# EAGLE design v1.2.0 (EAGLE 9.3.0)

## Sheet 1 of 2
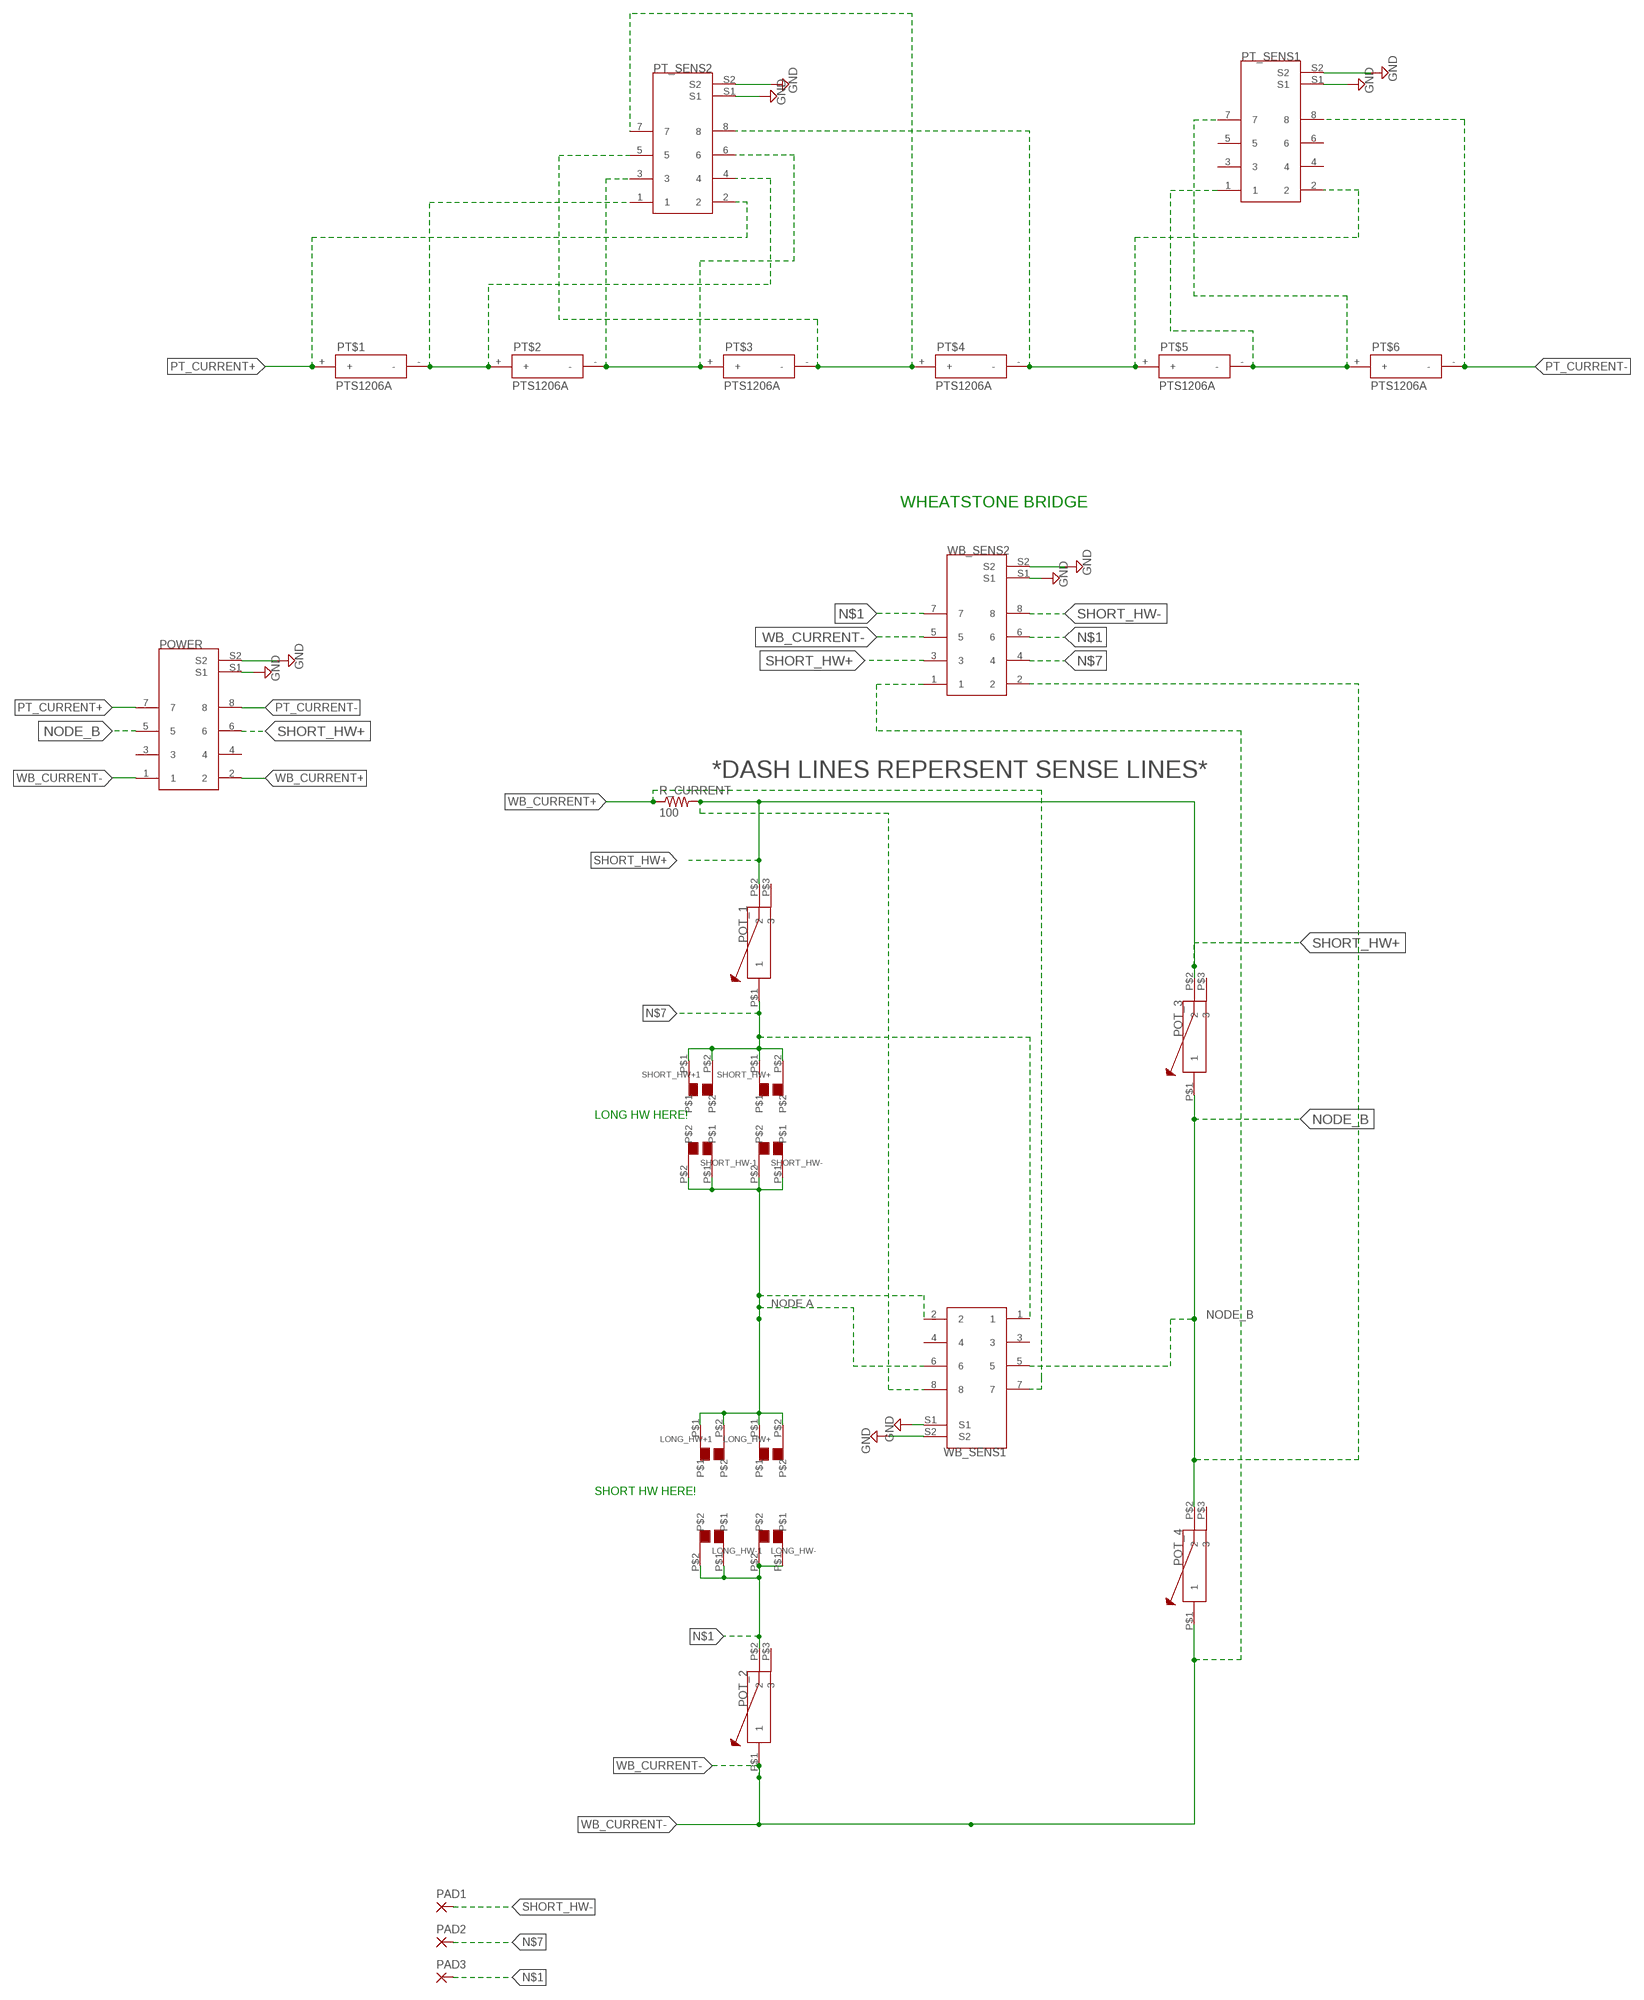
[diagram p0: schematic, sheet 1]

### Parts
LONG_HW+  WIREPOINT_1A  [WIREPOINT]
LONG_HW+1  WIREPOINT_1A  [WIREPOINT]
LONG_HW-  WIREPOINT_1A  [WIREPOINT]
LONG_HW-1  WIREPOINT_1A  [WIREPOINT]
PAD1  2,15/1,0  [2,15/1,0]
PAD2  2,15/1,0  [2,15/1,0]
PAD3  2,15/1,0  [2,15/1,0]
POT_1  67WR200LFR$1  [67WR200LF]
POT_2  67WR200LFR$1  [67WR200LF]
POT_3  67WR200LFR$1  [67WR200LF]
POT_4  67WR200LFR$1  [67WR200LF]
POWER  RJ45_CONNECTOR  [RJ45_CONNNECTOR]
PT$1  PTS1206A  [CAPMP3216X166]
PT$2  PTS1206A  [CAPMP3216X166]
PT$3  PTS1206A  [CAPMP3216X166]
PT$4  PTS1206A  [CAPMP3216X166]
PT$5  PTS1206A  [CAPMP3216X166]
PT$6  PTS1206A  [CAPMP3216X166]
PT_SENS1  RJ45_CONNECTOR  [RJ45_CONNNECTOR]
PT_SENS2  RJ45_CONNECTOR  [RJ45_CONNNECTOR]
R_CURRENT  100  R-US_M0805  [M0805]
SHORT_HW+  WIREPOINT_1A  [WIREPOINT]
SHORT_HW+1  WIREPOINT_1A  [WIREPOINT]
SHORT_HW-  WIREPOINT_1A  [WIREPOINT]
SHORT_HW-1  WIREPOINT_1A  [WIREPOINT]
WB_SENS1  RJ45_CONNECTOR  [RJ45_CONNNECTOR]
WB_SENS2  RJ45_CONNECTOR  [RJ45_CONNNECTOR]

### Nets
GND: POWER.S1 POWER.S2 PT_SENS1.S1 PT_SENS1.S2 PT_SENS2.S1 PT_SENS2.S2 WB_SENS1.S1 WB_SENS1.S2 WB_SENS2.S1 WB_SENS2.S2
N$1: LONG_HW-1.P$1 LONG_HW-1.P$2 LONG_HW-.P$1 LONG_HW-.P$2 PAD3.1(P) POT_2.P$2 WB_SENS2.6 WB_SENS2.7
N$3: PT$2.- PT$3.+ PT_SENS2.3 PT_SENS2.6
N$4: PT$3.- PT$4.+ PT_SENS2.5 PT_SENS2.7
N$5: PT$4.- PT$5.+ PT_SENS1.2 PT_SENS2.8
N$6: PT$5.- PT$6.+ PT_SENS1.1 PT_SENS1.7
N$7: PAD2.1(P) POT_1.P$1 SHORT_HW+1.P$1 SHORT_HW+1.P$2 SHORT_HW+.P$1 SHORT_HW+.P$2 WB_SENS1.1 WB_SENS2.4
N$9: PT$1.- PT$2.+ PT_SENS2.1 PT_SENS2.4
NODE_B: POT_3.P$1 POT_4.P$2 POWER.5 WB_SENS1.5 WB_SENS2.2
PT_CURRENT+: POWER.7 PT$1.+ PT_SENS2.2
PT_CURRENT-: POWER.8 PT$6.- PT_SENS1.8
SHORT_HW+: POT_1.P$2 POT_3.P$2 POWER.6 R_CURRENT.2 WB_SENS1.8 WB_SENS2.3
SHORT_HW-: LONG_HW+1.P$1 LONG_HW+1.P$2 LONG_HW+.P$1 LONG_HW+.P$2 PAD1.1(P) SHORT_HW-1.P$1 SHORT_HW-1.P$2 SHORT_HW-.P$1 SHORT_HW-.P$2 WB_SENS1.2 WB_SENS1.6 WB_SENS2.8
WB_CURRENT+: POWER.2 R_CURRENT.1 WB_SENS1.7
WB_CURRENT-: POT_2.P$1 POT_4.P$1 POWER.1 WB_SENS2.1 WB_SENS2.5
Unconnected: POT_1.P$3 POT_2.P$3 POT_3.P$3 POT_4.P$3 POWER.3 POWER.4 PT_SENS1.3 PT_SENS1.4 PT_SENS1.5 PT_SENS1.6 WB_SENS1.3 WB_SENS1.4

### Notes on the sheet
- WHEATSTONE BRIDGE
- *DASH LINES REPERSENT SENSE LINES*
- LONG HW HERE!
- NODE A
- SHORT HW HERE!

## Sheet 2 of 2

## Library data of the parts
LONG_HW+ LONG_HW+1 LONG_HW- LONG_HW-1 SHORT_HW+ SHORT_HW+1 SHORT_HW- SHORT_HW-1 = WIREPOINT:WIREPOINT_1
PAD1-PAD3 = wirepad:2,15/1,0: THROUGH-HOLE PAD
POT_1-POT_4 = POTENTIOMETER_67WR200LFR:67WR200LF
POWER PT_SENS1 PT_SENS2 WB_SENS1 WB_SENS2 = RJ45_CONNECTOR:RJ45_CONNECTOR
PT$1-PT$6 = PTS1206:PTS1206
R_CURRENT = resistor:R-US_: RESISTOR, American symbol

## Board
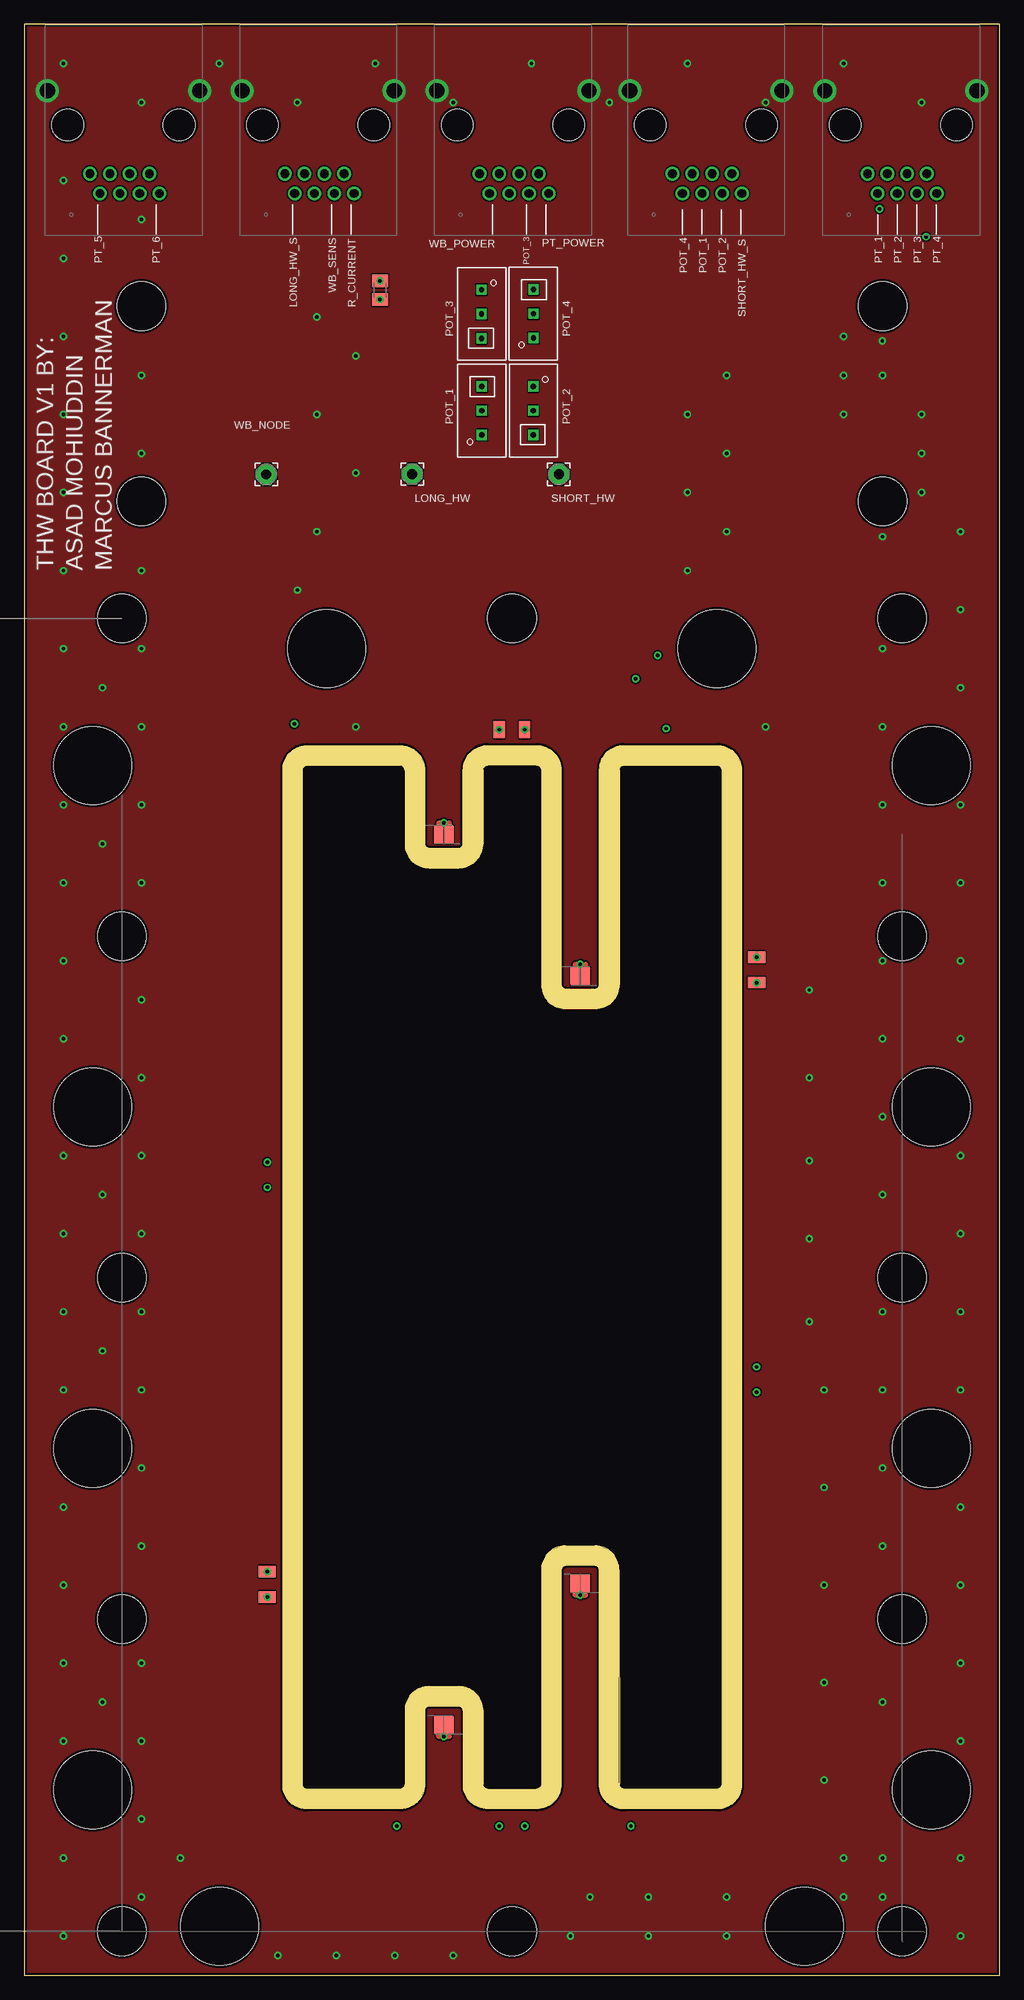
[diagram p1: board, top side]
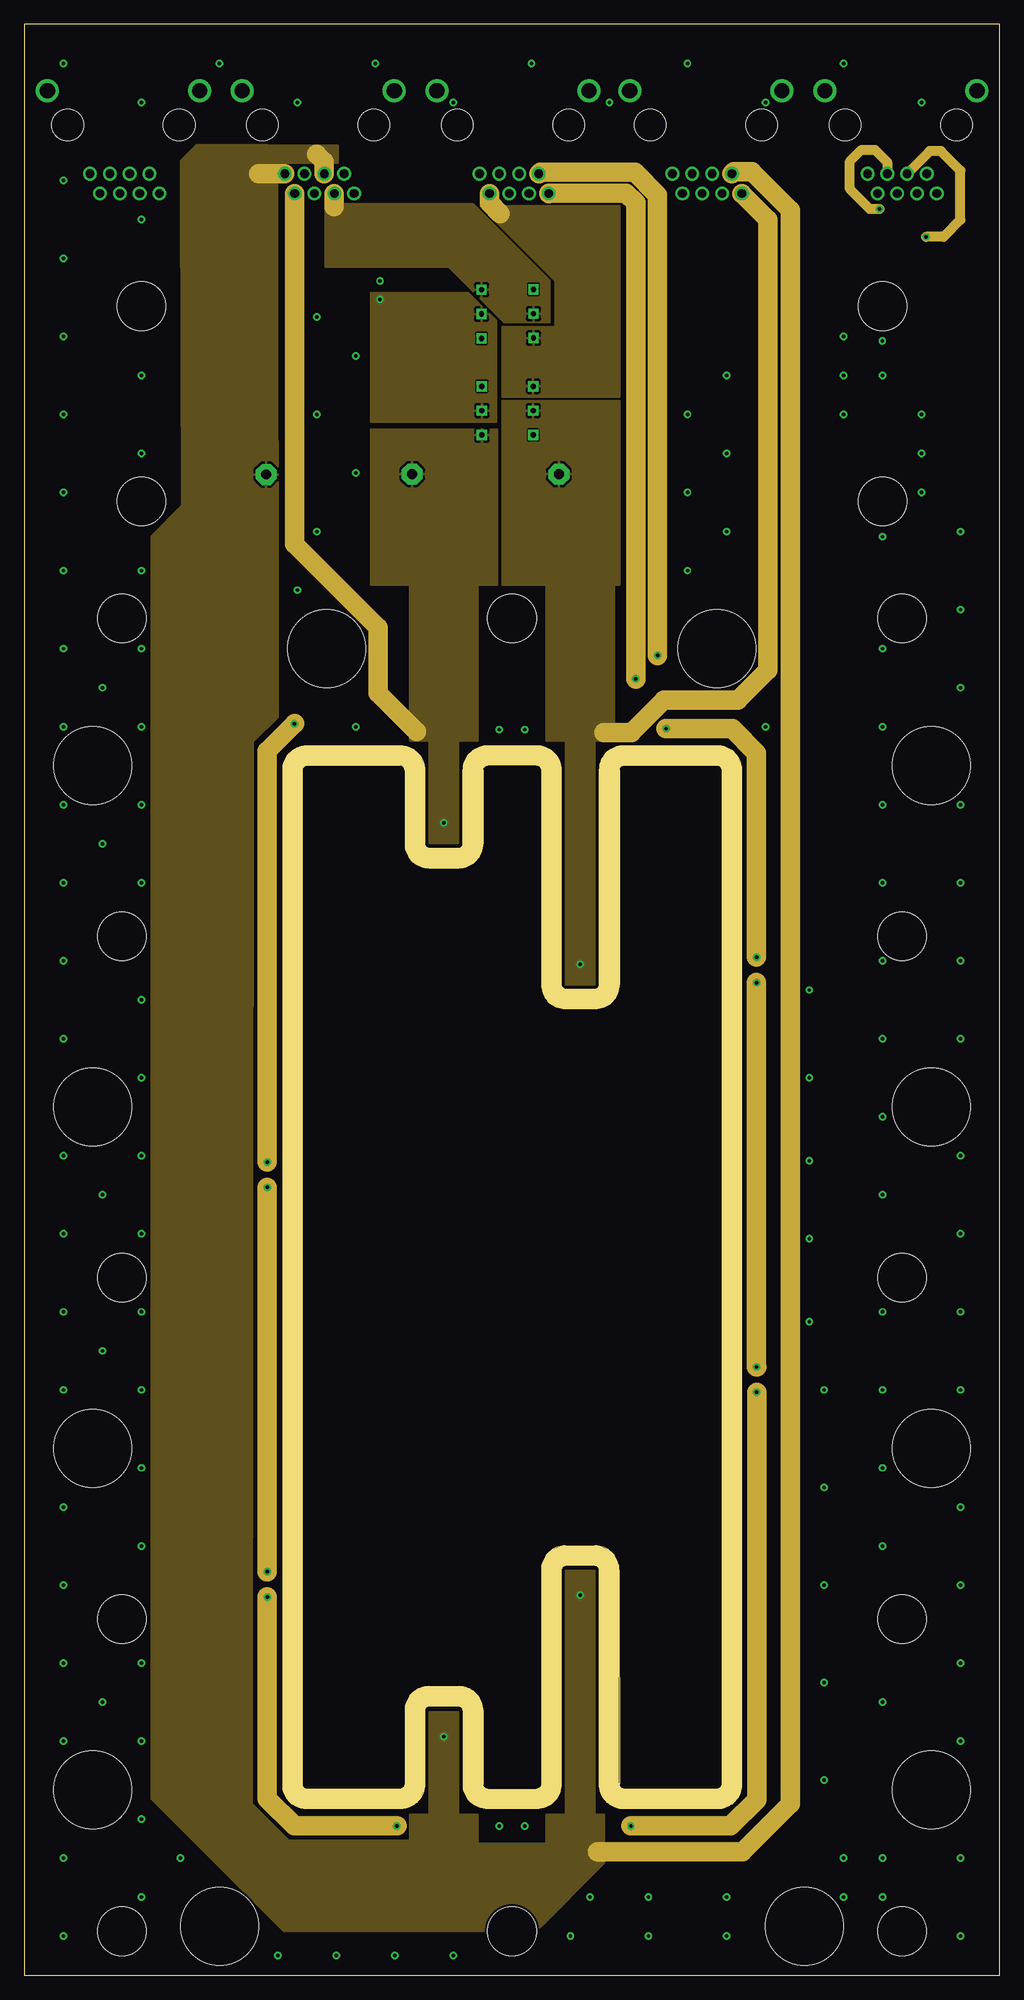
[diagram p2: board, inner layer Route2]
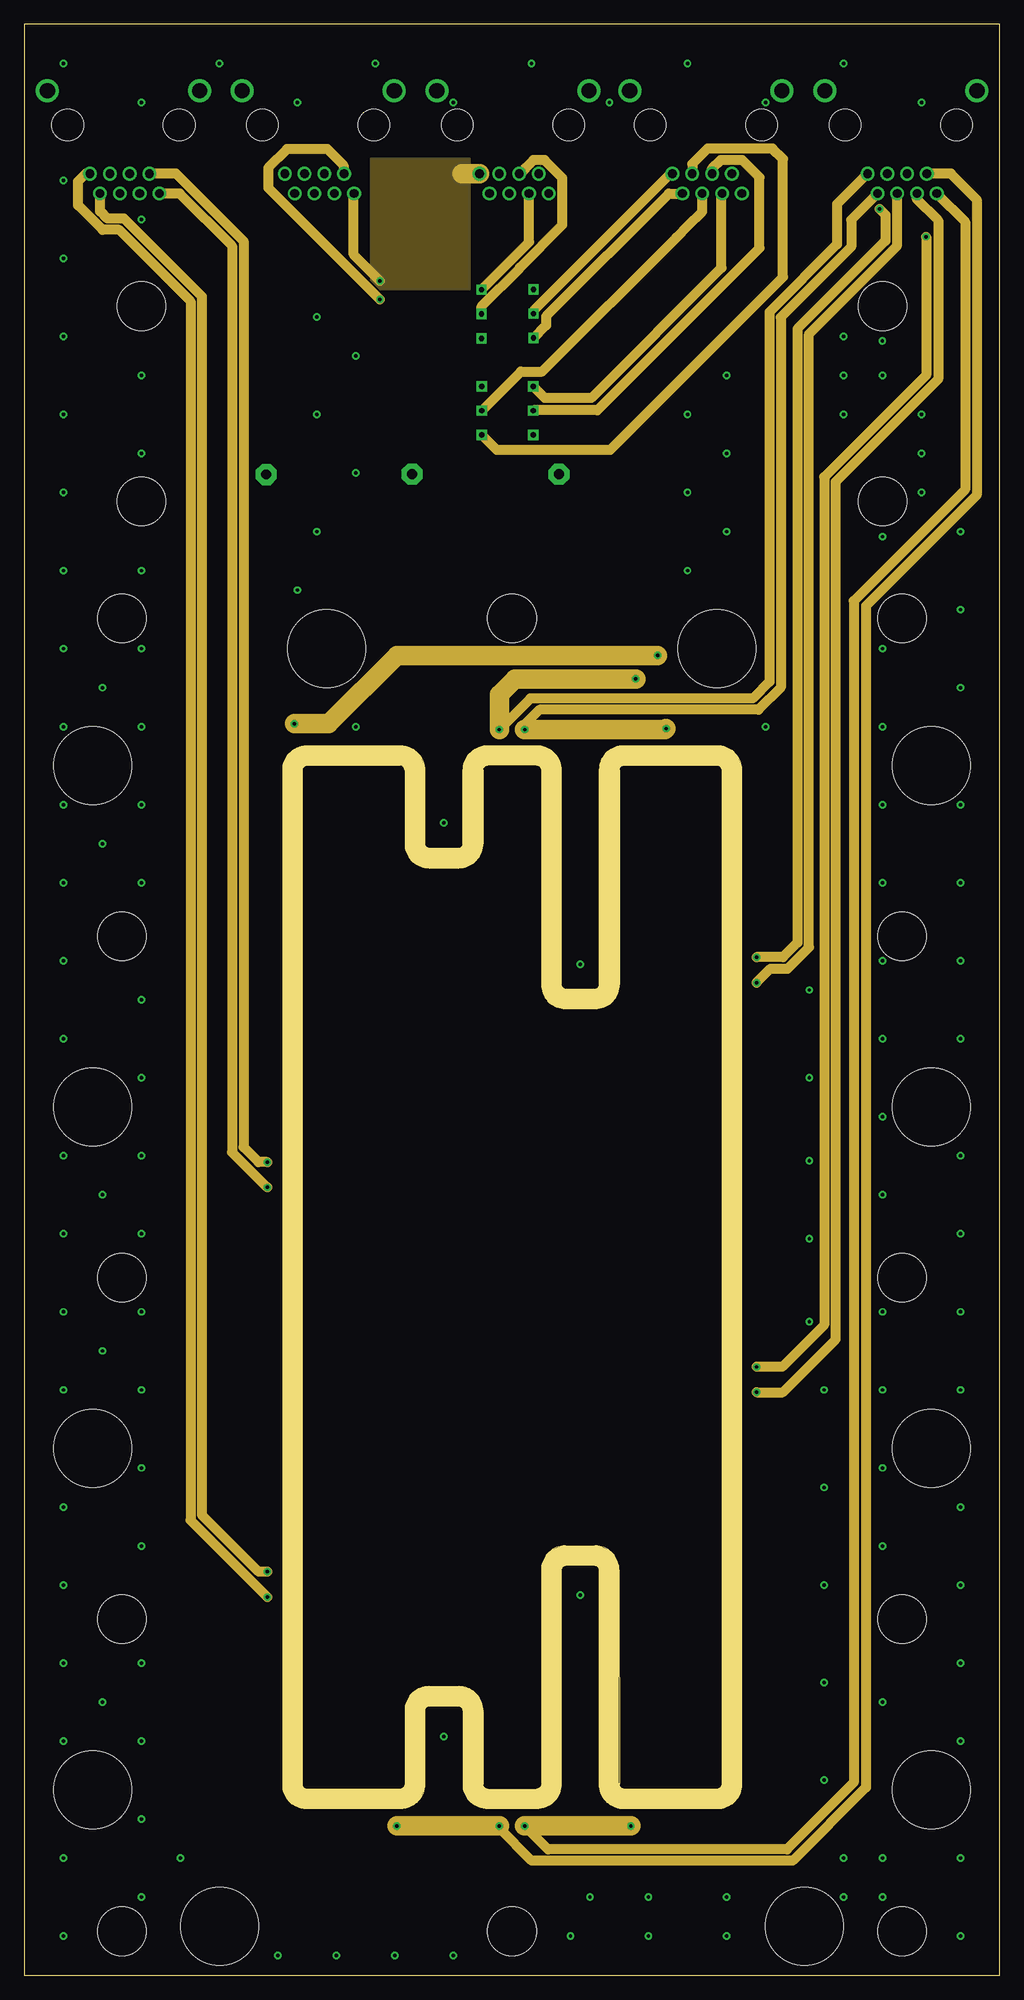
[diagram p3: board, inner layer Route3]
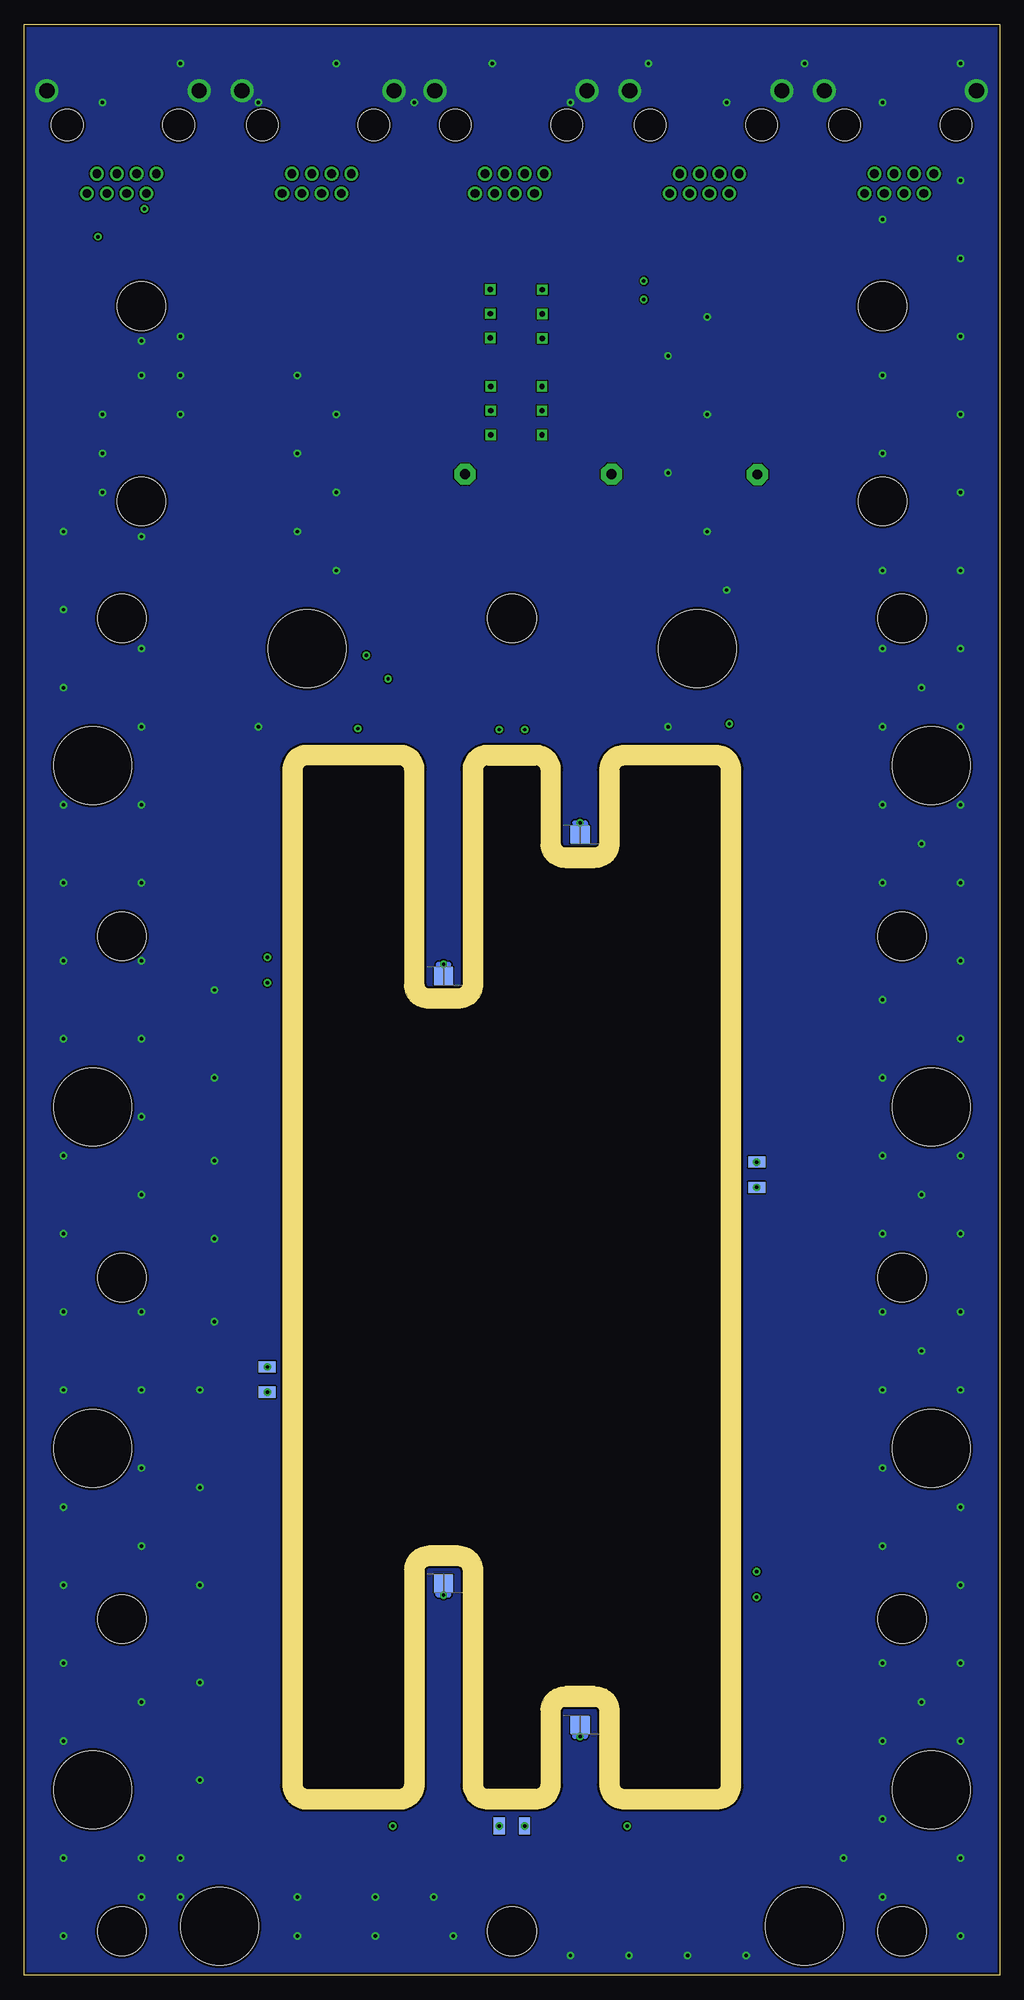
[diagram p4: board, bottom side, seen from below]

Size 100 x 200 mm. Coordinates in mm from the lower left corner, seen from the top.
Outline: 29.01,124.06 38.52,124.06 arc-90 39.02,123.56 39.02,115.99 arc90 41.48,113.53 44.56,113.53 arc90 47.02,115.99 47.02,123.56 arc-90 47.52,124.06 52.52,124.06 arc-90 53.02,123.56 53.02,101.55 arc90 55.48,99.09 58.56,99.09 arc90 61.02,101.55 61,123.56 arc-90 61.5,124.06 71.02,124.06 arc-90 71.52,123.56 71.52,19.56 arc-90 71.02,19.06 61.51,19.06 arc-90 61.01,19.56
Outline: 29.02,124.06 arc90 28.52,123.56 28.52,19.47 arc90 28.93,19.06 38.52,19.06 arc90 39.02,19.56 39.02,27.13 arc-90 41.48,29.59 44.56,29.59 arc-90 47.02,27.13 47.02,19.56 arc90 47.52,19.06 52.53,19.06 arc90 53.03,19.56
Outline: 61.01,19.54 60.99,41.55 arc90 58.53,44.01 55.47,44.01 arc90 53.01,41.55 53.03,19.54
Outline: 0,0 100,0 100,200 0,200 0,0
Outline: 28.94,17.04 arc-90 26.51,19.47 26.51,123.56 arc-90 29.02,126.07 38.52,126.07 arc-90 41.03,123.56 41.03,116.02 arc90 41.5,115.55 44.58,115.55 arc90 45,115.97 45,123.54 arc-90 47.54,126.08 52.51,126.08 arc-90 55.04,123.55 55.04,101.56 arc90 55.5,101.1 58.52,101.1 arc90 58.99,101.57 58.99,123.6 arc-90 61.47,126.08 71.03,126.08 arc-90 73.53,123.58 73.53,19.51 arc-90 71.05,17.03 61.5,17.03 arc-90 58.97,19.56 58.97,41.52 arc90 58.5,41.99 55.51,41.99 arc90 55.04,41.52 55.04,19.56 arc-90 52.53,17.05 47.51,17.05 arc-90 45.01,19.55 45.01,27.1 arc90 44.53,27.58 41.49,27.58 arc90 41.03,27.12 41.03,19.54 arc-90 38.53,17.04 28.94,17.04
Copper layers (1*2*3*16): Top 0.035mm / dielectric 0.8675mm / Route2 0.035mm / dielectric 0.15mm / Route3 0.035mm / dielectric 0.2mm / Bottom 0.035mm
Design rules "default *": minimum track width 6mil, minimum drill 0.35mm, track to track 6mil, track to pad 6mil, pad to pad 6mil, via to via 6mil, smd to smd 6mil, copper to edge 10mil, drill to drill 6mil, minimum pad ring 10mil, minimum via ring 8mil, stop-mask expansion 4mil, vias tented up to drill 0mil, thermal gap 10mil
Holes 5 mm at 50,139.1 10,36.5 90,36.5 50,4.5 90,106.5 10,139.1 90,139.1 10,4.5 90,4.5 10,71.5 10,106.5 90,71.5 12,151.1 12,171.1 88,171.1 88,151.1
Holes 8 mm at 7,19 7,54 7,89 7,124 31,136 71,136 80,5 93,19 93,54 93,89 93,124 20,5
Milling: 40 lines

### Footprints (pad centres in the part's own frame; a part is rotated, then mirrored left to right if it is on the bottom)
WIREPOINT = smd 0.914 x 1.778: P$1 -0.537,-0.001; P$2 0.54,0
2,15/1,0 = drill 1.016 pad 2.159 octagon: 1 0,0
67WR200LF = drill 0.55 square: P$1 7.25,2.5; P$2 4.75,2.5; P$3 2.25,2.5
RJ45_CONNNECTOR = drill 0.89: 1 10.47,17.27; 2 11.49,15.24; 3 8.44,17.27; 4 9.46,15.24; 5 6.41,17.27; 6 7.43,15.24; 7 4.38,17.27; 8 5.4,15.24 | drill 1.57: S1 0.265,6.73; S2 15.865,6.73 | hole 3.25: 2.35,10.24; 13.78,10.24
CAPMP3216X166 = smd 1.15 x 1.75: + 1.3,0; - -1.3,0
M0805 = smd 1.3 x 1.6: 1 -0.95,0; 2 0.95,0

### Placement (x,y rotation side)
LONG_HW+  57.02,40.15 0 top
LONG_HW+1  57.02,40.15 0 bottom
LONG_HW-  57.02,102.44 180 top
LONG_HW-1  57.02,102.44 0 bottom
PAD1  24.81,153.86 0 top
PAD2  39.77,153.89 0 top
PAD3  54.81,153.87 0 top
POT_1  44.42,165.15 270 top
POT_2  54.68,155.65 90 top
POT_3  49.38,165.55 90 top
POT_4  49.71,175.09 270 top
POWER  58.16,199.94 180 top
PT$1  50,127.7 180 top
PT$2  75.09,103.06 90 top
PT$3  75.1,61.06 90 bottom
PT$4  50,15.3 180 bottom
PT$5  24.9,40.06 270 top
PT$6  24.9,82.06 270 bottom
PT_SENS1  18.23,199.94 180 top
PT_SENS2  97.95,199.94 180 top
R_CURRENT  36.47,172.74 270 top
SHORT_HW+  43.02,116.94 180 top
SHORT_HW+1  43.02,116.94 0 bottom
SHORT_HW-  43.02,25.66 0 top
SHORT_HW-1  43.02,25.66 0 bottom
U$1  [AD_LOGO]  17.27,144.02 0 top
WB_SENS1  38.19,199.94 180 top
WB_SENS2  77.95,199.94 180 top

### Tracks (layer width: path | path; a pad name or v marks a point on that pad's centre or on a via)
GND  (via drill 0.35)
  other vias: 4,184 12,164 12,52 4,48 12,44 4,40 72,8 72,4 4,196 4,176 4,168 4,160 4,152 4,144 4,136 4,128 4,120 4,112 4,104 4,96 4,84 4,76 4,68 4,60 4,32 4,24 4,12 4,4 8,132 8,116 8,80 8,64 8,28 12,8 12,16 12,24 12,32 12,60 12,68 12,76 12,84 12,92 12,100 12,112 12,120 12,128 12,136 12,144 12,156 12,180 12,192 20,196 28,192 36,196 30,170 34,166 30,160 34,154 30,148 28,142 34,128 44,192 52,196 60,192 68,196 76,192 84,196 92,192 72,164 68,160 72,156 68,152 72,148 68,144 76,128 84,168 84,164 84,160 87.98,167.56 88,164 92,160 92,156 92,152 88,147.48 96,148 96,140 88,136 88,128 96,120 88,120 88,112 96,112 96,104 88,104 96,96 88,96 88,88 96,84 88,80 96,76 88,68 96,68 96,60 88,60 88,52 96,48 88,44 80.5,101 80.5,92 80.5,83.5 80.5,75.5 80.5,67 82,60 82,50 82,40 82,30 82,20 96,24 88,28 96,32 96,40 84,12 84,8 88,12 96,12 96,4 16,12 26,2 32,2 38,2 44,2 64,4 56,4 58,8 64,8 88,8 96,132
  pour Top (rank 3, no thermals): 0,0 100,0 100,200 0,200
  pour Bottom (rank 3, no thermals): 0,0 0,200 100,200 100,0
N$1  (via drill 0.35)
  Top 0.508: LONG_HW-1.P$2 56.48,103.64 v57.02,103.64 57.56,103.64 LONG_HW-1.P$1
  Route2 2: WB_SENS2.7 76.25,179.99 76.25,133.82 73.18,130.75 65.59,130.75 62.23,127.38 59.44,127.38
  Route3 1.016: POT_2.P$2 52.21,160.43 58.75,160.43 75.38,177.07 75.38,184.32 73.62,186.08 71.38,186.08 70.52,185.23 WB_SENS2.6
  Bottom 0.508: LONG_HW-1.P$2 56.48,103.64 v57.02,103.64 57.56,103.64 LONG_HW-1.P$1
  pour Route2: 49,161.4 61.1,161.4 61.1,142.5 49,142.5
  pour Route2: 58.5,101.5 55.5,101.5 55.5,126.5 53.5,126.5 53.5,142.5 60.5,142.5 60.5,126.5 58.5,126.5
N$3  (via drill 0.35)
  Route2 1.016: v92.47,178.23 94.27,178.23 96,179.96 96,185 94,187 92.83,187 PT_SENS2.6
  Route2 2: PT$2.- PT$3.+
  Route3 1.016: PT$3.+ 77.72,62.36 82.03,66.67 82.03,153.59 92.47,164.03 v92.47,178.23 | PT$2.- 76.52,103.19 78.28,103.19 80.45,105.36 80.45,168.25 89.46,177.25 89.46,182.61 PT_SENS2.3
  other vias: 75.09,101.76 75.1,62.36
N$4  (via drill 0.35)
  Route2 2: PT$3.- 75.1,18 72.4,15.3 v62.2,15.3
  Route3 1.016: PT$4.+ 53.7,12.9 78.2,12.9 85.05,19.75 85.05,140.88 96.47,152.3 96.47,179.76 PT_SENS2.7 | PT$3.- 77.76,59.76 83.19,65.19 83.19,153.1 93.7,163.61 93.7,179.9 91.54,182.06 PT_SENS2.5
  Route3 2: v62.2,15.3 PT$4.+
  other vias: 75.1,59.76 51.3,15.3
N$5  (via drill 0.35)
  Route2 2: v38.2,15.3 27.7,15.3 24.9,18.1 PT$5.+
  Route3 1.016: PT$4.- 48.7,15.05 52.02,11.73 78.78,11.73 86.3,19.25 86.3,140.38 97.65,151.73 97.65,182.05 95,184.69 PT_SENS2.8 | PT$5.+ 17.03,46.63 17.03,171.6 9.7,178.93 8.02,178.93 5.5,181.45 5.5,183.9 6.29,184.69 PT_SENS1.2
  Route3 2: PT$4.- v38.2,15.3
  other vias: 48.7,15.3 24.9,38.76
N$6  (via drill 0.35)
  Route2 2: PT$6.+ PT$5.-
  Route3 1.016: PT$6.+ 21.3,84.36 21.3,177.3 15.94,182.66 PT_SENS1.7 | PT$5.- 24.04,41.36 18.2,47.2 18.2,172.12 10.22,180.1 8.5,180.1 7.76,180.84 PT_SENS1.1
  other vias: 24.9,41.36 24.9,80.76
N$7  (via drill 0.35)
  Top 0.508: SHORT_HW+1.P$1 43.56,118.14 v43.02,118.14 42.48,118.14 SHORT_HW+1.P$2
  Route2 2: WB_SENS1.1 27.72,146.71 36.25,138.18 36.25,131.42 40.2,127.47
  Route3 1.016: POT_1.P$1 48.42,156.4 60.1,156.4 77.8,174.1 77.8,186.21 76.73,187.28 70.06,187.28 68.49,185.72 WB_SENS2.4
  Bottom 0.508: SHORT_HW+1.P$1 43.56,118.14 v43.02,118.14 42.48,118.14 SHORT_HW+1.P$2
  pour Route2: 46.5,126.5 44.5,126.5 44.5,116 41.5,116 41.5,126.5 39.5,126.5 39.5,143 46.5,143
  pour Route2: 48.5,158.5 35.5,158.5 35.5,142.5 48.5,142.5
N$9  (via drill 0.35)
  Route2 1.016: v87.7,181.07 86.7,181.07 84.67,183.1 84.67,185.96 85.85,187.14 87.23,187.14 88.49,185.88 PT_SENS2.4
  Route2 2: v65.8,127.8 72.6,127.8 75.09,125.31 PT$2.+
  Route3 1.016: PT$2.+ 77.8,104.36 79.29,105.85 79.29,168.79 88.29,177.8 88.29,180.48 v87.7,181.07 | PT$1.- 51.3,128.2 52.83,129.73 75.28,129.73 77.57,132.02 77.57,169.97 84.79,177.19 84.79,179.97 PT_SENS2.1
  Route3 2: v65.8,127.8 65.7,127.7 PT$1.-
  other vias: 51.3,127.7 75.09,104.36
NODE_B
  Route2 2: WB_SENS1.5 31.78,181.3
  Route3 1.016: POT_4.P$2 52.21,170.64 66.27,184.69 WB_SENS2.2 | POT_3.P$1 51.75,177.67 POWER.5
  pour Route2: 53.9,169.4 49.24,169.4 43.5,175.14 43.5,181.6 46,181.6 53.9,173.7
  pour Route2: 43.6,181.6 30.84,181.6 30.84,175.1 43.6,175.1
PT_CURRENT+  (via drill 0.35)
  Route2 2: POWER.7 53.82,182.7 61.7,182.7 62.7,181.7 v62.7,132.9
  Route3 1.016: PT$1.+ 51.9,130.9 74.7,130.9 76.4,132.6 76.4,170.51 83.33,177.44 83.33,181.57 PT_SENS2.2
  Route3 2: PT$1.+ 48.7,131.3 50.3,132.9 v62.7,132.9
  other vias: 48.7,127.7
PT_CURRENT-  (via drill 0.35)
  Route2 2: PT$6.- 24.9,125.5 v27.7,128.3 | POWER.8 52.93,184.85 62.59,184.85 64.93,182.51 v64.93,135.3
  Route3 1.016: PT$6.- 24,83.36 22.47,84.89 22.47,177.78 15.56,184.69 PT_SENS1.8
  Route3 2: v64.93,135.3 38.2,135.3 31.2,128.3 v27.7,128.3
  other vias: 24.9,83.36
SHORT_HW+  (via drill 0.35)
  Route3 1.016: POT_1.P$2 50.92,164.4 53.1,164.4 66.85,178.15 68.04,179.34 69.51,180.81 WB_SENS2.3 | R_CURRENT.2 25.01,183.25 25.01,185.29 26.92,187.21 31.07,187.21 32.73,185.55 32.73,184.75 WB_SENS1.8 | POT_3.P$2 46.88,171.09 50.8,175.01 50.8,175.07 55.17,179.44 55.17,184.25 53.34,186.08 52.19,186.08 51.37,185.27 51.37,185.2 50.8,184.63 POWER.6
  other vias: 36.47,171.79
  pour Route2: 35.5,172.5 45.5,172.5 48.4,169.6 48.4,159.2 35.5,159.2
SHORT_HW-  (via drill 0.35)
  Top 0.508: SHORT_HW-1.P$2 42.48,24.46 v43.02,24.46 43.56,24.46 SHORT_HW-1.P$1 | LONG_HW+1.P$2 56.48,38.95 v57.02,38.95 57.56,38.95 LONG_HW+1.P$1
  Route2 2: WB_SENS1.6 30.76,185.9 29.95,186.71 | WB_SENS1.2 24,184.69 | WB_SENS2.8 72.75,184.9 74.61,184.9 78.53,180.97 78.53,106.05 78.55,106.03 78.55,17.55 73.64,12.64 58.75,12.64
  Bottom 0.508: SHORT_HW-1.P$2 42.48,24.46 v43.02,24.46 43.56,24.46 SHORT_HW-1.P$1 | LONG_HW+1.P$2 56.48,38.95 v57.02,38.95 57.56,38.95 LONG_HW+1.P$1
  pour Route2: 16.01,183.17 16.14,150.64 13,147.5 13,18.08 26.63,4.45 52.5,4.5 59.5,11.5 59.5,16.5 58.5,16.5 58.5,41.5 55.5,41.5 55.5,16.5 53.5,16.5 53.5,13.5 46.5,13.5 46.5,16.5 44.5,16.5 44.5,27 41.5,27 41.5,16.5 39.5,16.5 39.5,13.84 27.08,13.84 23.34,17.58 23.47,126.42 23.47,126.47 26,129 25.99,185.75 32.19,185.75 32.19,187.63 17.71,187.71 16.01,186.01
  pour Top: 42.14,26.15 42.86,26.15 42.86,25.21 42.13,25.21 42.13,26.15
  pour Top: 43.16,26.19 43.16,25.19 43.93,25.19 43.93,26.19
WB_CURRENT+  (via drill 0.35)
  Route3 1.016: R_CURRENT.1 33.76,176.4 33.76,182.62 WB_SENS1.7
  Route3 2: POWER.2 44.87,184.69
  other vias: 36.47,173.69
  pour Route3: 35.5,186.3 35.5,172.8 45.7,172.8 45.7,186.3
WB_CURRENT-
  Route2 2: POWER.1 47.69,181.7 48.79,180.6
  Route3 1.016: POT_4.P$1 53.51,169.14 53.51,170.08 66.09,182.66 WB_SENS2.1 | POT_2.P$1 53.38,161.7 58.15,161.7 71.5,175.05 71.5,182.62 WB_SENS2.5
  pour Route2: 49,161.8 49,169 54.4,169 54.4,173.7 46.7,181.4 61.1,181.4 61.1,161.8

### Text on the board
tPlace: WB_POWER | PT_POWER | PT_5 | PT_1 | PT_2 | PT_3 | PT_4 | PT_6 | POT_3 | POT_4 | POT_1 | POT_2 | WB_SENS | LONG_HW_S | R_CURRENT | SHORT_HW_S | POT_3 | POT_4 | POT_1 | POT_2 | WB_NODE | LONG_HW | SHORT_HW | THW BOARD V1 BY: | ASAD MOHIUDDIN | MARCUS BANNERMAN